# EAGLE design 4915dec (EAGLE 6.6.0)
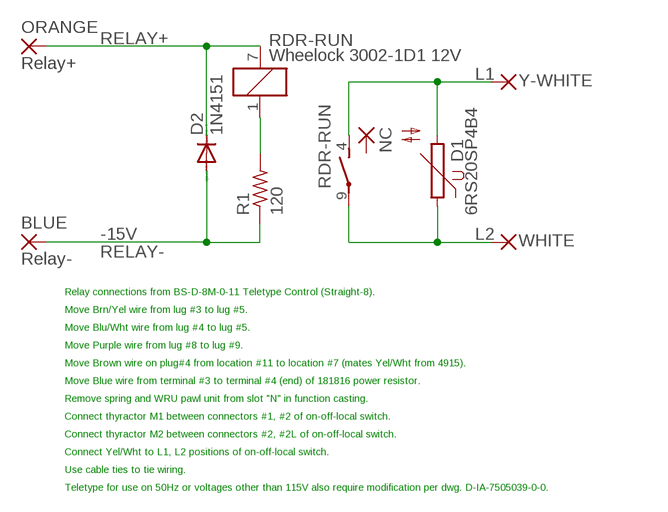
[diagram p0: schematic, sheet 1]

## Parts
BLUE  Relay-  3,17/1,3  [3,17/1,3]
D1  6RS20SP4B4  [6RS20SP4B4]
D2  1N4151  1N4148DO35-10  [DO35-10]
NC  3,17/1,3  [3,17/1,3]
ORANGE  Relay+  3,17/1,3  [3,17/1,3]
R1  120  R-US_0207/10  [0207/10]
RDR-RUN  Wheelock 3002-1D1 12V  3002-1D1  [3002-1D1]
WHITE  L2  3,17/1,3  [3,17/1,3]
Y-WHITE  L1  3,17/1,3  [3,17/1,3]

## Nets
-15V: BLUE.1(P) D2.A R1.1
L1: D1.2 RDR-RUN.4 Y-WHITE.1(P)
L2: D1.1 RDR-RUN.9 WHITE.1(P)
N$1: R1.2 RDR-RUN.1
RELAY+: D2.C ORANGE.1(P) RDR-RUN.7
Unconnected: NC.1(P)

## Notes on the sheet
- RELAY-
- Relay connections from BS-D-8M-0-11 Teletype Control (Straight-8).
- Move Brn/Yel wire from lug #3 to lug #5.
- Move Blu/Wht wire from lug #4 to lug #5.
- Move Purple wire from lug #8 to lug #9.
- Move Brown wire on plug#4 from location #11 to location #7 (mates Yel/Wht from 4915).
- Move Blue wire from terminal #3 to terminal #4 (end) of 181816 power resistor.
- Remove spring and WRU pawl unit from slot "N" in function casting.
- Connect thyractor M1 between connectors #1, #2 of on-off-local switch.
- Connect thyractor M2 between connectors #2, #2L of on-off-local switch.
- Connect Yel/Wht to L1, L2 positions of on-off-local switch.
- Use cable ties to tie wiring.
- Teletype for use on 50Hz or voltages other than 115V also require modification per dwg. D-IA-7505039-0-0.

## Library data of the parts
BLUE NC ORANGE WHITE Y-WHITE = wirepad:3,17/1,3: THROUGH-HOLE PAD
D1 = dec-con:6RS20SP4B4: 6RS20SP4B4 Varistor
D2 = diode:1N4148: DIODE high speed (Philips)
R1 = rcl:R-US_: RESISTOR, American symbol
RDR-RUN = dec-con:3002-1D1: Wheelock 262-2L5X1 DTP Relay

## Net classes
0 default: width 0.813 mm

## Board
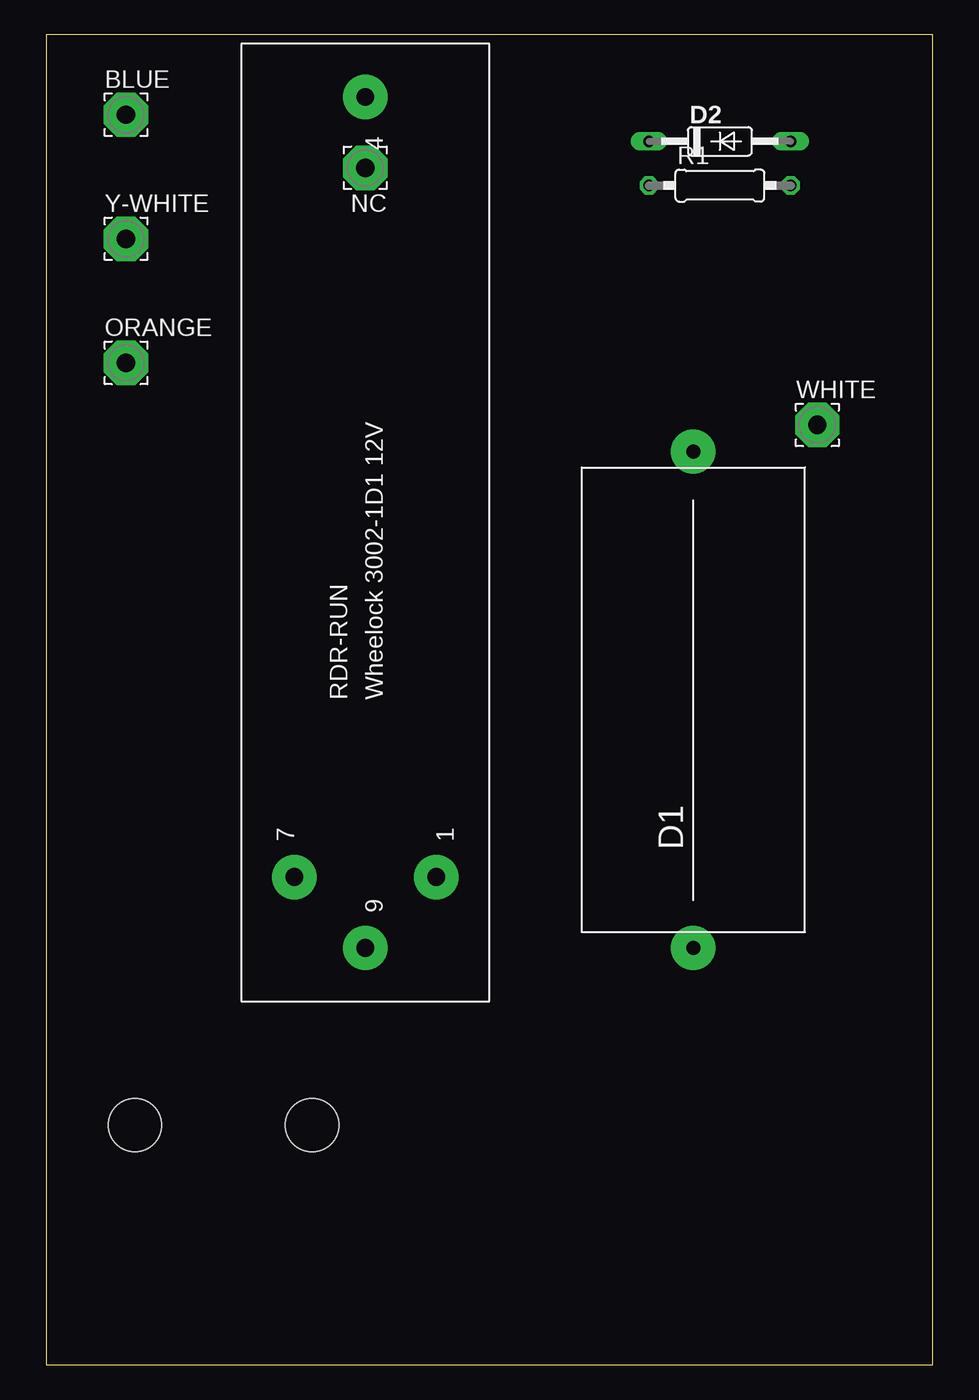
[diagram p1: board, top side]
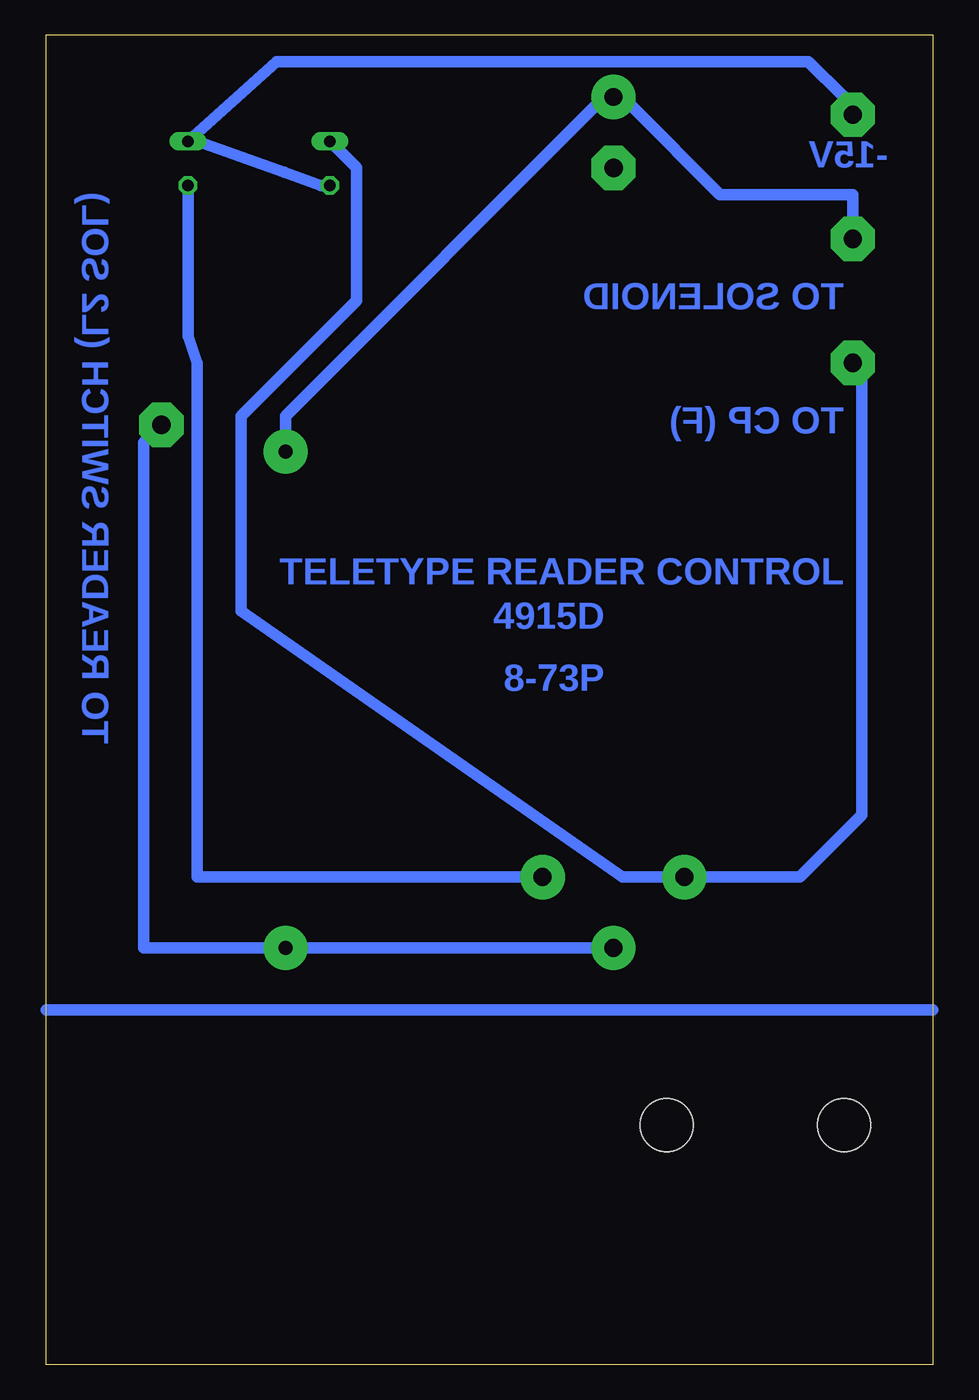
[diagram p2: board, bottom side, seen from below]

Size 63.5 x 95.25 mm. Coordinates in mm from the lower left corner, seen from the top.
Outline: 63.5,0 63.5,95.25 0,95.25 0,0 63.5,0
Copper layers (1+16): Top 0.035mm / dielectric 1.5mm / Bottom 0.035mm
Design rules "16mils": minimum track width 16mil, minimum drill 32mil, track to track 15mil, track to pad 10mil, pad to pad 10mil, via to via 10mil, smd to smd 10mil, copper to edge 13mil, drill to drill 10mil, minimum pad ring 10mil, minimum via ring 8mil, stop-mask expansion 0mil, vias tented up to drill 0mil, thermal gap 10mil
Holes 3.81 mm at 6.35,17.14 19.05,17.14

### Footprints (pad centres in the part's own frame; a part is rotated, then mirrored left to right if it is on the bottom)
3,17/1,3 = drill 1.321 pad 3.175 octagon: 1 0,0
6RS20SP4B4 = drill 1.016 pad 3.175: 1 -17.78,0; 2 17.78,0
DO35-10 = drill 0.813 long: A 5.08,0; C -5.08,0
0207/10 = drill 0.813 octagon: 1 -5.08,0; 2 5.08,0
3002-1D1 = drill 1.27 pad 3.175: 1 -25.4,-5.08; 4 30.48,0; 7 -25.4,5.08; 9 -30.48,0

### Placement (x,y rotation side)
BLUE  5.71,89.53 0 top
D1  46.35,47.62 90 top
D2  48.26,87.63 0 top
NC  22.86,85.72 180 top
ORANGE  5.71,71.75 0 top
R1  48.26,84.45 0 top
RDR-RUN  22.86,60.33 90 top
WHITE  55.24,67.31 0 top
Y-WHITE  5.71,80.64 0 top

### Tracks (layer width: path | path; a pad name or v marks a point on that pad's centre or on a via)
-15V
  Bottom 0.813: R1.1 43.81,84.45 46.47,85.4 52.7,87.63 D2.A 46.99,93.34 8.89,93.34 6.35,90.81 BLUE.1
L1
  Bottom 0.813: Y-WHITE.1 5.71,83.82 15.24,83.82 21.59,90.17 RDR-RUN.4 23.5,90.81 46.35,67.94 D1.2
L2
  Bottom 0.813: RDR-RUN.9 24.13,29.84 45.72,29.84 D1.1 48.26,29.84 56.52,29.84 56.52,65.41 56.52,66.04 WHITE.1
N$1
  Bottom 0.813: R1.2 53.34,73.66 52.7,71.75 52.7,34.92 RDR-RUN.1
N$6
  Bottom 0.813: 0,25.4 63.5,25.4
RELAY+
  Bottom 0.813: D2.C 41.27,85.72 41.27,76.2 49.53,67.94 49.53,53.98 22.23,34.92 RDR-RUN.7 9.53,34.92 5.08,39.37 5.08,70.48 ORANGE.1

### Text on the board
Bottom: -15V | TO SOLENOID | TO CP (F) | TELETYPE READER CONTROL | 4915D | 8-73P | TO READER SWITCH (L2 SOL)
tValues: Relay- | L1 | Relay+ | L2 | WHT - 6 | BLK - 7 | RED - 4 | GRN - 3 | Also: | on the TTY